# Altium project Fri3D_2020_02.PrjPcb
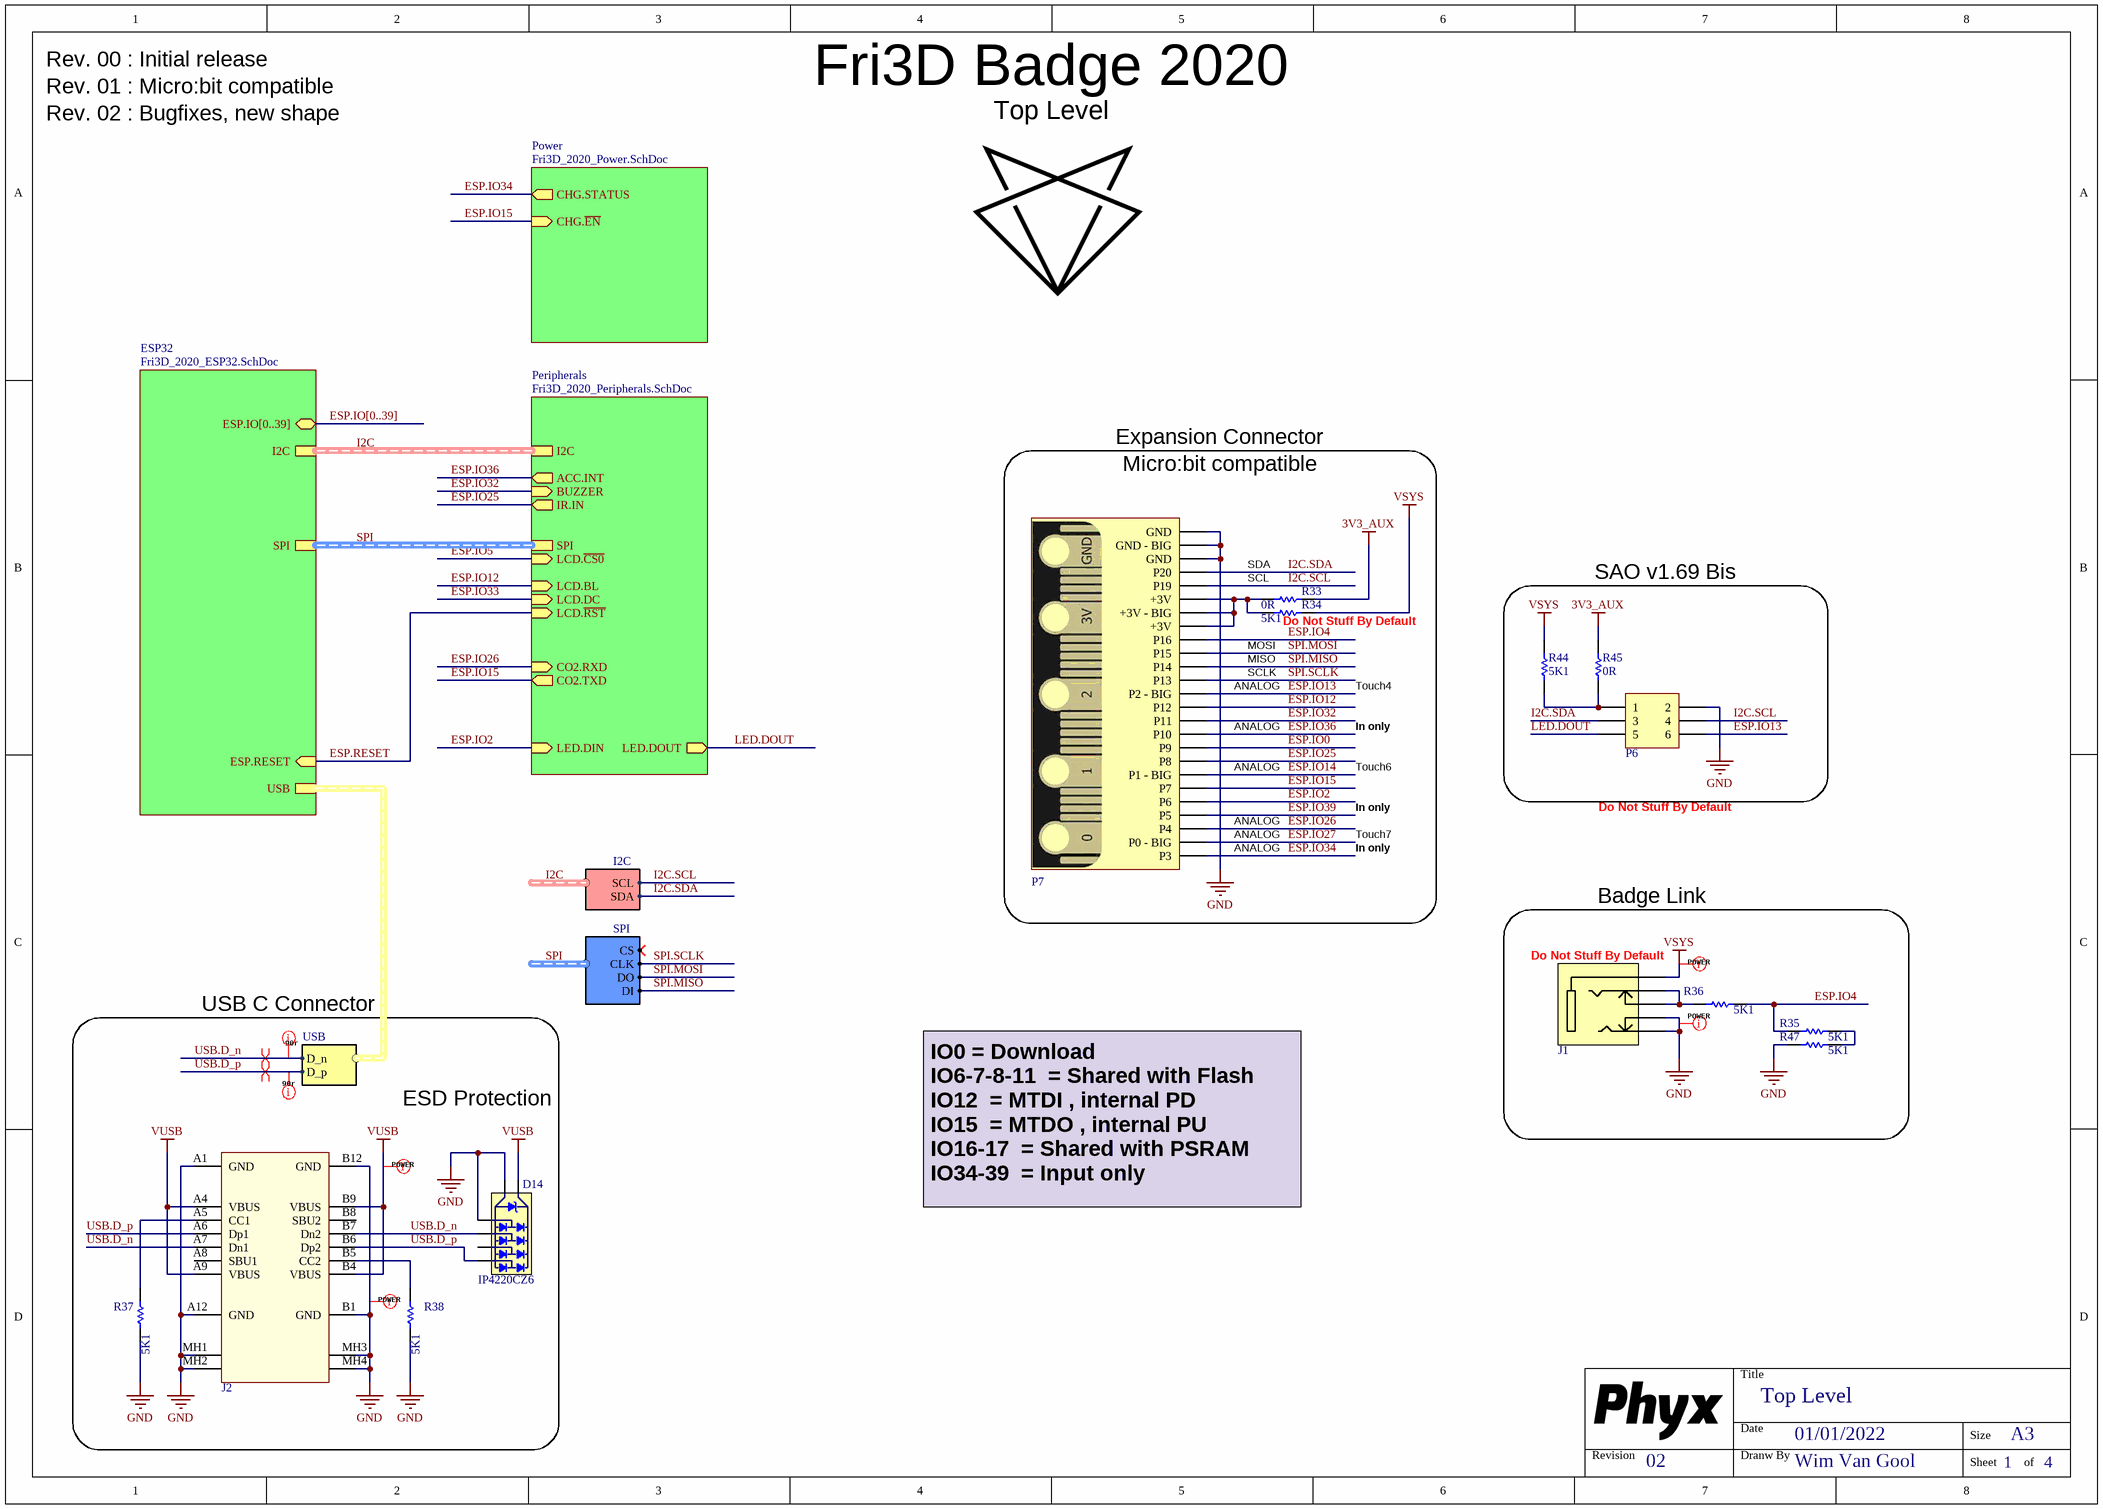
[diagram p0: Fri3D_2020_02.SchDoc]
PCB_ENGINEER: WimVG; PCB_REV: 02; PCB_TITLE: Fri3D Badge 2020
4 sheets, 118 parts. Net scope: hierarchical (ports join the sheet entries above them; power ports are global).
Board file: Fri3D_2020_02.PcbDoc
Sheets:
  Fri3D_2020_02.SchDoc
    Peripherals = Fri3D_2020_Peripherals.SchDoc
    Power = Fri3D_2020_Power.SchDoc
    ESP32 = Fri3D_2020_ESP32.SchDoc

## Sheet Fri3D_2020_02.SchDoc: Top Level
size A3; Date: 01/01/2022; DrawnBy: Wim Van Gool; DocumentNumber: 1; Revision: 02; SheetNumber: 1; SheetTotal: 4

### Parts
D14  value IP4220CZ6  [NXP_SOT457]  (hidden comment: TVS Diode Dual USB)
J1  3.5mm jack, dual switch, black, 3 contacts  [CUI_SJ1-3525NG]  (value not drawn)
J2  USB 2.0 C Reversible Receptacle Horizontal  [HRO_TYPE-C-31-M-12]  (value not drawn)
P6  Receptacle 3x2  [RCPT2X3]  (value not drawn)
P7  MicroBit PCB connector  [MicroBIT_V2_PCB]  (value not drawn)
R33  value 0R  [R0603_N]  (hidden comment: RESISTOR)
R34  value 5K1  [R0603_N]  (hidden comment: RESISTOR)
R35  value 5K1  [R0603_N]  (hidden comment: RESISTOR)
R36  value 5K1  [R0603_N]  (hidden comment: RESISTOR)
R37  value 5K1  [R0603_N]  (hidden comment: RESISTOR)
R38  value 5K1  [R0603_N]  (hidden comment: RESISTOR)
R44  value 5K1  [R0603_N]  (hidden comment: RESISTOR)
R45  value 0R  [R0603_N]  (hidden comment: RESISTOR)
R47  value 5K1  [R0603_N]  (hidden comment: RESISTOR)

### Blocks framed on the sheet
SAO v1.69 Bis: P6 R44 R45
Badge Link: J1 R35 R36 R47

### Sub-sheets
ESP32 = Fri3D_2020_ESP32.SchDoc: I2C (harness I2C), USB (harness USB), SPI (harness SPI), ESP.RESET (in), ESP.IO[0..39] (bidir)
Peripherals = Fri3D_2020_Peripherals.SchDoc: I2C (harness I2C), ACC.INT (out), BUZZER (in), LED.DIN (in), LED.DOUT (out), SPI (harness SPI), IR.IN (out), LCD.DC (in), LCD.~{RST} (in), LCD.~{CS0} (in), LCD.BL (in), CO2.TXD (out), CO2.RXD (in)
Power = Fri3D_2020_Power.SchDoc: CHG.STATUS (out), CHG.~{EN} (in)

### Harnesses
USB: D_p, D_n
I2C: SDA, SCL
SPI: CS, CLK, DO, DI

### Nets
3V3_AUX: R33.1 R45.1
GND: D14.2(GND) D14.3 J1.2(Tip) J1.4 J2.A1(GND) J2.A12(GND) J2.B1(GND) J2.B12(GND) J2.MH1(Tab) J2.MH2(Tab) J2.MH3(Tab) J2.MH4(Tab) P6.2 P7.23(GND) P7.24(GND_-_BIG) P7.25(GND) R37.2 R38.2 R47.2
VSYS: J1.1(Sleeve) R34.2 R44.2
VUSB: D14.5(VBus) J2.A4(VBUS) J2.A9(VBUS) J2.B4(VBUS) J2.B9(VBUS)
ESP.IO0: P7.9(P9)
ESP.IO2: P7.5(P6) ; sheet Peripherals/LED.DIN
ESP.IO4: P7.17(P16) R35.2 R36.1
ESP.IO12: P7.12(P12) ; sheet Peripherals/LCD.BL
ESP.IO13: P6.6 P7.13(P2_-_BIG)
ESP.IO14: P7.7(P1_-_BIG)
ESP.IO15: P7.6(P7) ; sheet Peripherals/CO2.TXD, sheet Power/CHG.~{EN}  [project net CO2.TXD]
ESP.IO25: P7.8(P8) ; sheet Peripherals/IR.IN
ESP.IO26: P7.3(P4) ; sheet Peripherals/CO2.RXD  [project net CO2.RXD]
ESP.IO27: P7.2(P0_-_BIG)
ESP.IO32: P7.11(P11) ; sheet Peripherals/BUZZER  [project net BUZZER]
ESP.IO34: P7.1(P3) ; sheet Power/CHG.STATUS
ESP.IO36: P7.10(P10) ; sheet Peripherals/ACC.INT  [project net ACC.INT2]
ESP.IO39: P7.4(P5)
ESP.RESET: sheet Peripherals/LCD.~{RST}, sheet ESP32/ESP.RESET
I2C.SCL: P6.4 P7.21(P19) ; sheet Peripherals/I2C.SCL
I2C.SDA: P6.3 P7.22(P20) ; sheet Peripherals/I2C.SDA
LED.DOUT: P6.5 ; sheet Peripherals/LED.DOUT
SPI.MISO: P7.15(P14) ; sheet Peripherals/SPI.DI  [project net SPI.DI]
SPI.MOSI: P7.16(P15) ; sheet Peripherals/SPI.DO  [project net SPI.DO]
SPI.SCLK: P7.14(P13) ; sheet Peripherals/SPI.CLK  [project net SPI.CLK]
USB.D_n: D14.1 J2.A7(Dn1) J2.B7(Dn2) ; sheet ESP32/USB.D_n
USB.D_p: D14.6 J2.A6(Dp1) J2.B6(Dp2) ; sheet ESP32/USB.D_p
NetJ1_3: J1.3(Ring) J1.5 R36.2
NetJ2_A5: J2.A5(CC1) R37.1
NetJ2_B5: J2.B5(CC2) R38.1
NetP6_1: P6.1 R44.1 R45.2
NetP7_18: P7.18(+3V) P7.19(+3V_-_BIG) P7.20(+3V) R33.2 R34.1
NetR35_1: R35.1 R47.1

Not connected (* = marked no-connect by the designer): D14 4; J2 A8(SBU1) B8(SBU2)

### Buses and harness runs
bus ESP.IO[0..39] = sheet ESP32/ESP.IO[0..39]
harness I2C = sheet ESP32/I2C = sheet Peripherals/I2C
harness SPI = sheet ESP32/SPI = sheet Peripherals/SPI

### Layout directives
net class 90r: USB.D_n, USB.D_p
differential pair: USB.D_n, USB.D_p
net class POWER: GND, VSYS, VUSB

### Notes on the sheet
- Rev. 00 : Initial release
- Rev. 01 : Micro:bit compatible
- Rev. 02 : Bugfixes, new shape
- Expansion Connector
- Micro:bit compatible
- SDA
- SCL
- MOSI
- (near R34) Do Not Stuff By Default
- ANALOG
- MISO
- SCLK
- Touch4
- Touch6
- In only
- Touch7
- Do Not Stuff By Default
- (near J1) Do Not Stuff By Default
- USB C Connector
- ESD Protection
- IO0	= Download
  IO6-7-8-11 	= Shared with Flash
  IO12 	= MTDI , internal PD
  IO15 	= MTDO , internal PU
  IO16-17 	= Shared with PSRAM
  IO34-39 	= Input only
- Title
- Revision
- Date
- Dranw By
- Size
- A3
- Sheet
- of

### Library data of the parts
D14 = TVS # IP4220CZ6 Dual USB: =Description; Supplier 1: Farnell; Supplier Part Number 1: 2143248
J1 = AUDIO JACK 3.5 3c SJ1-3525NG: =Description; Value: SJ1-3525NG; Supplier 1: Digi-key; Supplier Part Number 1: CP1-3525NG-ND
J2 = USB # C 2.0 RCPT TYPE-C-31-M-12: Value: TYPE-C-31-M-12; Supplier 1: China; Supplier Part Number 1: HRO TYPE-C-31-M-12; Supplier 2: LCSC; Supplier Part Number 2: C165948; Supplier 3: LCSC ALT; Supplier Part Number 3: C167321 / C319148
P6 = Receptacle 2.54mm dual row 6way
P7 = MicroBit # PCB part: Supplier 1: NO PART
R33 R45 = RES # 0R 0603: Supplier 1: Farnell; Supplier Part Number 1: 2447743; Supplier 3: Generic; Supplier Part Number 3: 0R 1% 0603
R34-R38 R44 R47 = RES # 5K1 0603: Supplier 1: Farnell; Supplier Part Number 1: 2845922
  R36: Supplier 2: LCSC; Supplier Part Number 2: C112314; Supplier 3: Generic; Supplier Part Number 3: 5K1 1% 0603

## Sheet Fri3D_2020_Peripherals.SchDoc: Peripherals
size A3; Date: 01/01/2022; DrawnBy: Wim Van Gool; DocumentNumber: 3; Revision: 02; SheetNumber: 3; SheetTotal: 4
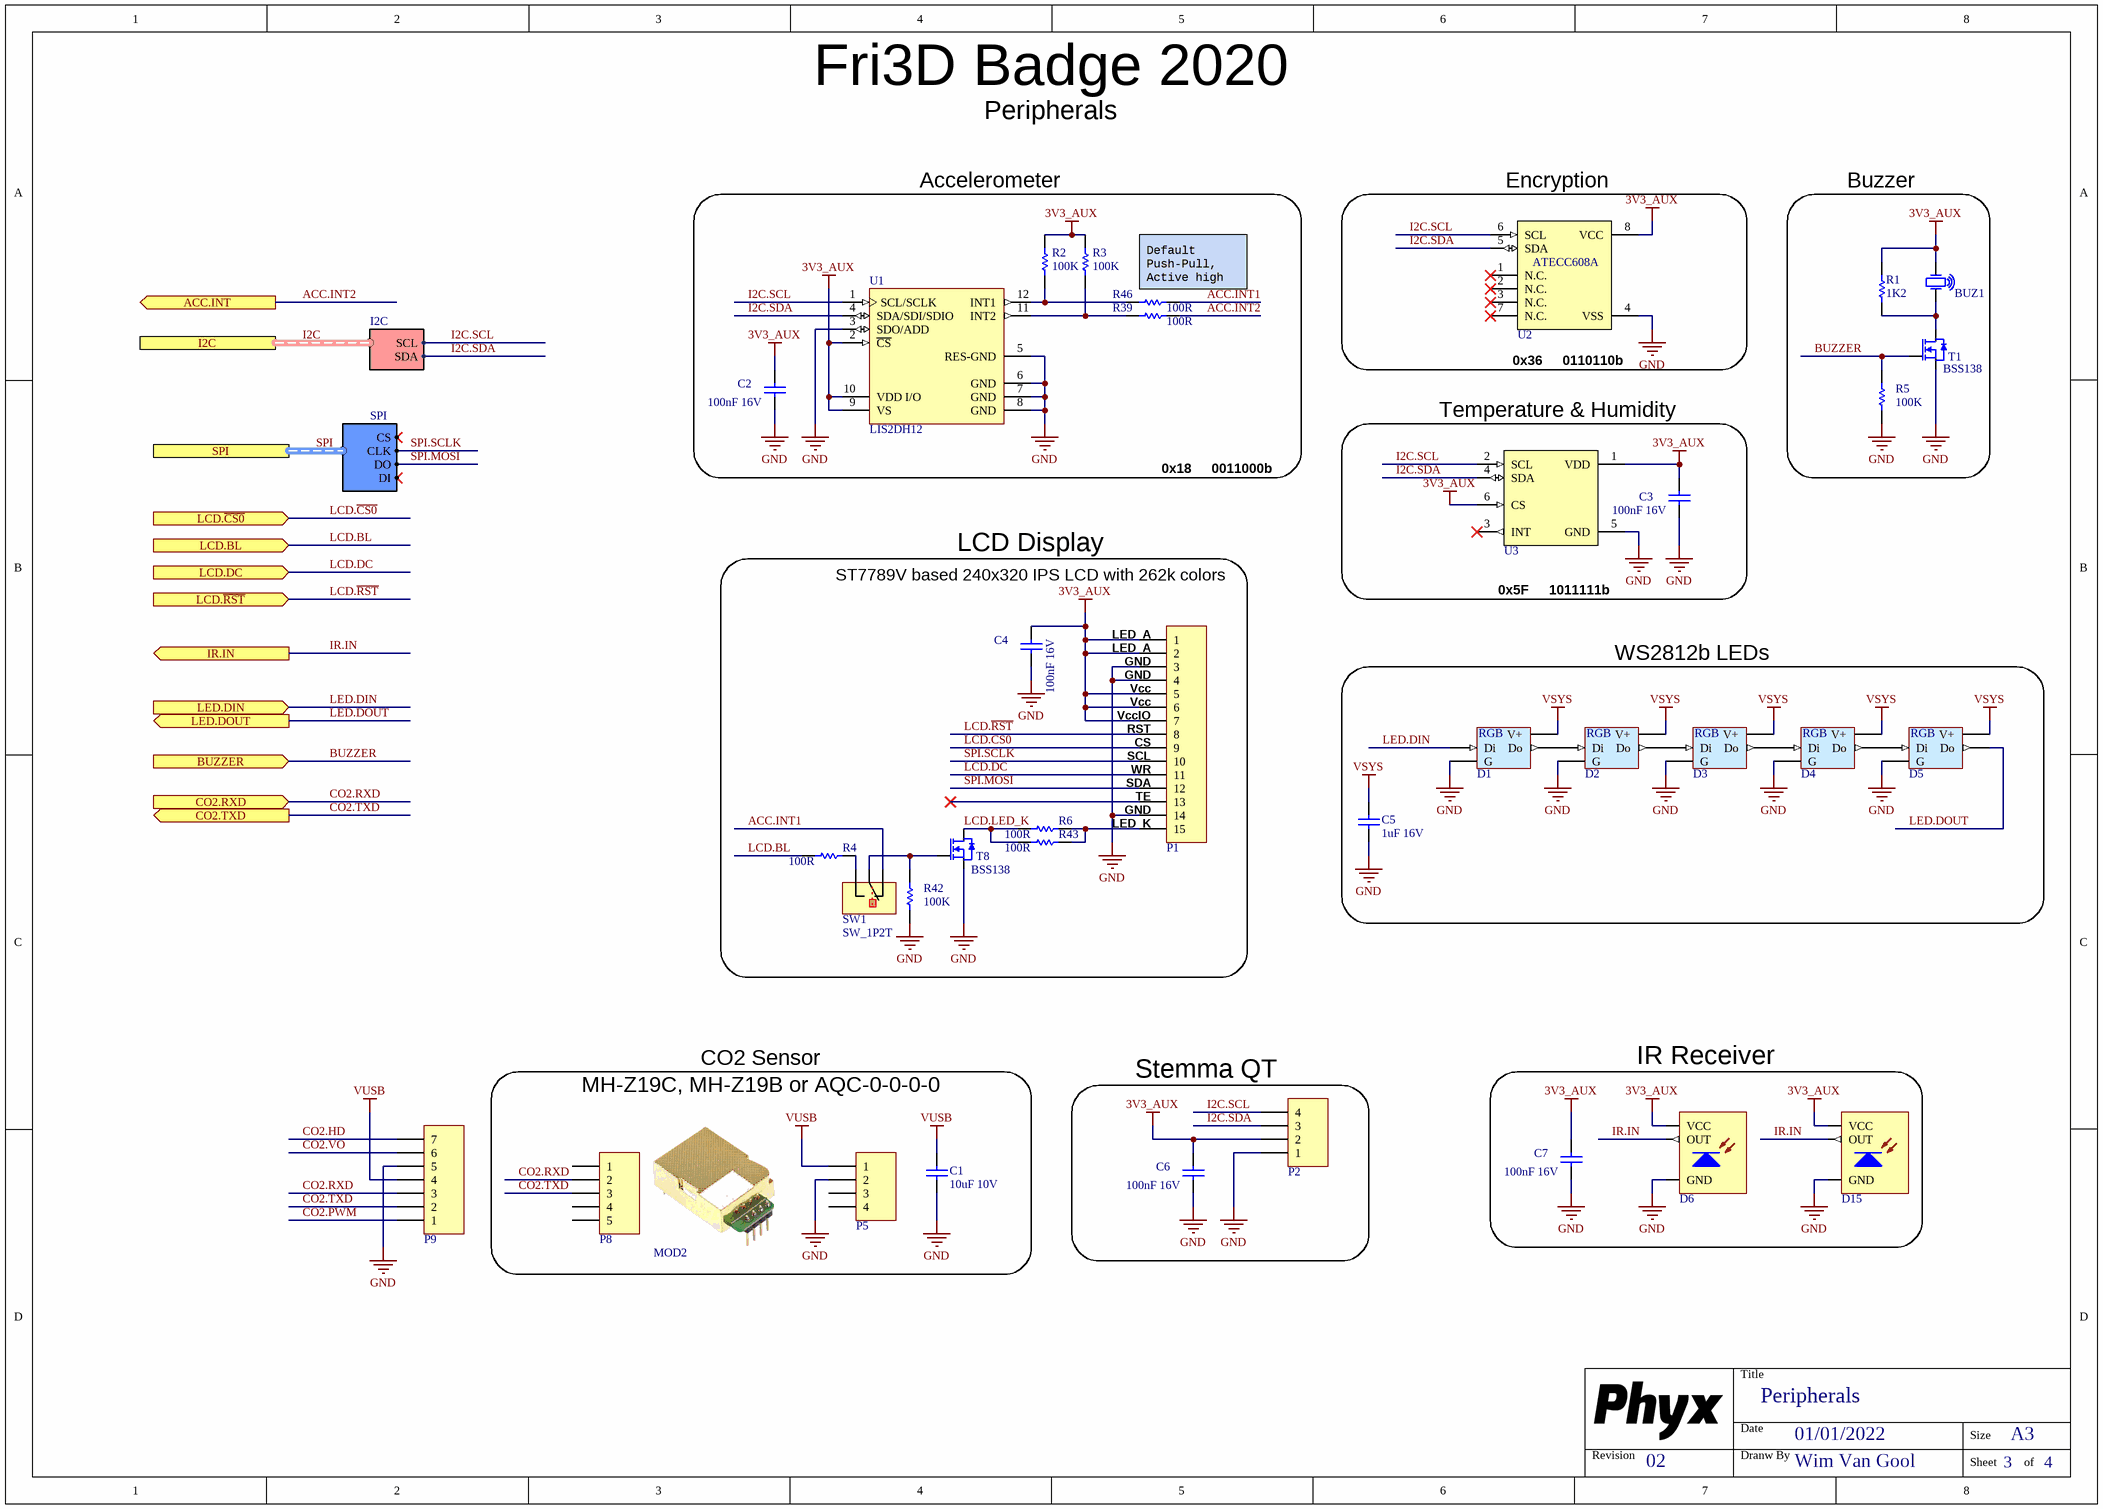
[diagram p1: Fri3D_2020_Peripherals.SchDoc]

### Parts
BUZ1  12x12x3mm Piezo Buzzer Transducer 81dB  [CUI_CMT-1203-SMT]  (value not drawn)
C1  value 10uF 10V  [C0805_N]  (hidden comment: CAP_CERAMIC)
C2  value 100nF 16V  [C0603_N]
C3  value 100nF 16V  [C0603_N]
C4  value 100nF 16V  [C0603_N]
C5  value 1uF 16V  [C0603_N]  (hidden comment: CAP_CERAMIC)
C6  value 100nF 16V  [C0603_N]
C7  value 100nF 16V  [C0603_N]
D1  WS2812 based digital RGB LED 5050 Black package  [LED_5050_WS2812B_BLACK]  (value not drawn)
D2  WS2812 based digital RGB LED 5050 Black package  [LED_5050_WS2812B_BLACK]  (value not drawn)
D3  WS2812 based digital RGB LED 5050 Black package  [LED_5050_WS2812B_BLACK]  (value not drawn)
D4  WS2812 based digital RGB LED 5050 Black package  [LED_5050_WS2812B_BLACK]  (value not drawn)
D5  WS2812 based digital RGB LED 5050 Black package  [LED_5050_WS2812B_BLACK]  (value not drawn)
D6  IRM-3638N3F14 Infrared Receiver 38 kHz 45° 2.7-5.5V  [VIS_TSOP381x_BENT]  (value not drawn)
D15  ZIRM-5042B-42-Z2 Infrared Receiver 38 kHz 45° 2.7-5.5V 940nm  [CHAU_ZIRM-5042B-42-Z2]  (value not drawn)
MOD2  MH-Z19C CO2 Sensor TH Pins  [WIN_MH-Z19x-PH]  (value not drawn)
P1  Bottom contact FPC 0.3mm pitch 15 contacts  [FPC_AFE03-S15FMA-1H]  (value not drawn)
P2  Header 1.0mm RA Shrouded 4  [WE_665104131822]  (value not drawn)
P5  Receptacle 4 SMD Type 2  [WE_61000413321]  (value not drawn)
P8  Receptacle 5 SMD Type 2  [WE_61000513321]  (value not drawn)
P9  Molex Picoblade SMD RA 532610771  [MLX_53261-0771]  (value not drawn)
R1  value 1K2  [R0603_N]  (hidden comment: RESISTOR)
R2  value 100K  [R0603_N]  (hidden comment: RESISTOR)
R3  value 100K  [R0603_N]  (hidden comment: RESISTOR)
R4  value 100R  [R0603_N]  (hidden comment: RESISTOR)
R5  value 100K  [R0603_N]  (hidden comment: RESISTOR)
R6  value 100R  [R0603_N]  (hidden comment: RESISTOR)
R39  value 100R  [R0603_N]  (hidden comment: RESISTOR)
R42  value 100K  [R0603_N]  (hidden comment: RESISTOR)
R43  value 100R  [R0603_N]  (hidden comment: RESISTOR)
R46  value 100R  [R0603_N]  (hidden comment: RESISTOR)
SW1  SW_1P2T  [WE_450404015514]
T1  value BSS138  [SOT23-3]  (hidden comment: 0.2A N-Ch MOSFET Vgs 3.2)
T8  value BSS138  [SOT23-3]  (hidden comment: 0.2A N-Ch MOSFET Vgs 3.2)
U1  LIS2DH12  [STM_LGA12_2x2]
U2  Encryption Authentication with 72b SN, SHA-256, AES-128  [SOIC_N_8]  (value not drawn)
U3  WSEN-HIDS 2525020210001 temperature and humidity sensor Digital I2C  [WE_2525020210001]  (value not drawn)

### Blocks framed on the sheet
Accelerometer: C2 R2 R3 R39 R46 U1
Encryption: U2
Buzzer: BUZ1 R1 R5 T1
Temperature & Humidity: C3 U3
LCD Display: C4 P1 R4 R6 R42 R43 SW1 T8
WS2812b LEDs: C5 D1-D5
Stemma QT: C6 P2
IR Receiver: C7 D6 D15

### Ports
ACC.INT (out), BUZZER (in), CO2.RXD (in), CO2.TXD (out), I2C (harness I2C), IR.IN (out), LCD.BL (in), LCD.DC (in), LCD.~{CS0} (in), LCD.~{RST} (in), LED.DIN (in), LED.DOUT (out), SPI (harness SPI)

### Harnesses
I2C: SDA, SCL
SPI: CS, CLK, DO, DI

### Nets
3V3_AUX: BUZ1.1(OSC1) C2.1 C3.1 C4.1 C6.1 C7.1 D6.3(VCC) D15.3(VCC) P1.1 P1.2 P1.5 P1.6 P1.7 P2.2 R1.1 R2.1 R3.1 U1.2(~{CS}) U1.9(VS) U1.10(VDD_I/O) U2.8(VCC) U3.1(VDD) U3.6(CS)
GND: C1.2 C2.2 C3.2 C4.2 C5.2 C6.2 C7.2 D1.3(G) D2.3(G) D3.3(G) D4.3(G) D5.3(G) D6.2(GND) D15.2(GND) P1.3 P1.4 P1.14 P2.1 P5.2 P9.5 R5.2 R42.2 T1.2(S) T8.2(S) U1.3(SDO/ADD) U1.5(RES-GND) U1.6(GND) U1.7(GND) U1.8(GND) U2.4(VSS) U3.5(GND)
VSYS: C5.1 D1.1(V+) D2.1(V+) D3.1(V+) D4.1(V+) D5.1(V+)
VUSB: C1.1 P5.1 P9.4
ACC.INT1: R46.2 SW1.1
ACC.INT2: R39.2 ; port ACC.INT
BUZZER: R5.1 T1.1(G) ; port BUZZER
CO2.HD: P9.7
CO2.PWM: P9.1
CO2.RXD: P8.2 P9.3 ; port CO2.RXD
CO2.TXD: P8.3 P9.2 ; port CO2.TXD
CO2.VO: P9.6
I2C.SCL: P2.4 U1.1(SCL/SCLK) U2.6(SCL) U3.2(SCL) ; port I2C.SCL
I2C.SDA: P2.3 U1.4(SDA/SDI/SDIO) U2.5(SDA) U3.4(SDA) ; port I2C.SDA
IR.IN: D6.1(OUT) D15.1(OUT) ; port IR.IN  [project net ESP.IO25]
LCD.BL: R4.2 ; port LCD.BL  [project net ESP.IO12]
LCD.~{CS0}: P1.9 ; port LCD.~{CS0}  [project net ESP.IO5]
LCD.DC: P1.11 ; port LCD.DC  [project net ESP.IO33]
LCD.LED_K: R6.2 R43.2 T8.3(D)
LCD.~{RST}: P1.8 ; port LCD.~{RST}  [project net ESP.RESET]
LED.DIN: D1.4(Di) ; port LED.DIN  [project net ESP.IO2]
LED.DOUT: D5.2(Do) ; port LED.DOUT
SPI.MOSI: P1.12 ; port SPI.DO  [project net SPI.DO]
SPI.SCLK: P1.10 ; port SPI.CLK  [project net SPI.CLK]
NetBUZ1_2: BUZ1.2(OSC2) R1.2 T1.3(D)
NetD1_2: D1.2(Do) D2.4(Di)
NetD2_2: D2.2(Do) D3.4(Di)
NetD3_2: D3.2(Do) D4.4(Di)
NetD4_2: D4.2(Do) D5.4(Di)
NetP1_15: P1.15 R6.1 R43.1
NetR2_2: R2.2 R46.1 U1.12(INT1)
NetR3_2: R3.2 R39.1 U1.11(INT2)
NetR4_1: R4.1 SW1.3
NetR42_1: R42.1 SW1.2 T8.1(G)

Not connected (* = marked no-connect by the designer): P1 13*; P5 3 4; P8 1 4 5; U2 1(N.C.)* 2(N.C.)* 3(N.C.)* 7(N.C.)*; U3 3(INT)*

### Buses and harness runs
harness I2C = port I2C
harness SPI = port SPI

### Notes on the sheet
- (near R46) Default Push-Pull, Active high
- (near U2) 0x36
- (near U2) 0110110b
- 0x18
- 0011000b
- ST7789V based 240x320 IPS LCD with 262k colors
- (near P1) LED_A
- (near P1) GND
- (near U3) 0x5F
- (near U3) 1011111b
- (near P1) Vcc
- (near P1) VccIO
- (near P1) RST
- (near P1) CS
- (near P1) SCL
- (near P1) WR
- (near P1) SDA
- (near P1) TE
- (near P1) LED_K
- CO2 Sensor
- MH-Z19C, MH-Z19B or AQC-0-0-0-0
- Title
- Revision
- Date
- Dranw By
- Size
- A3
- Sheet
- of
- (in symbol CRYPTO # ATECC608A I2C SOIC-8) ATECC608A
- (in symbol LED # RGB WS2812B-5050 BL) RGB

### Library data of the parts
BUZ1 = BUZ # CUI CMT-1203-SMT: Crystal Oscillator; Value: CMT-1203-SMT; Supplier 1: Digikey; Supplier Part Number 1: 102-2197-1-ND; Supplier 2: Aliexpress; Supplier Part Number 2: KLJ-1230
C1 = CAP # 10uF 10V 0805: Capacitor Ceramic; Supplier 1: Farnell; Supplier Part Number 1: 2320859
C2-C4 C6 C7 = CAP # 100nF 16V 0603: Capacitor Ceramic
C5 = CAP # 1uF 16V 0603: Capacitor Ceramic; Supplier 1: Farnell; Supplier Part Number 1: 2320814
D1-D5 = LED # RGB WS2812B-5050 BL: =Description; Value: WS218B 5050 BL; Supplier 1: Aliexpress; Supplier Part Number 1: WS2812B Black 5050
D6 = PHO IR Rx RA: =Description; Value: IRM-3638N3F14; Supplier 1: LCSC; Supplier Part Number 1: C264262
D15 = PHO # IR Rx 940nm ZIRM-5042B-42-Z2: =Description; Value: ZIRM-5042B-42-Z2; Supplier 1: LCSC; Supplier Part Number 1: C575386
MOD2 = CO2 MH-Z19C-PH: Winsen MH-Z19x-PH series of CO2 sensors; Description: CO2 MH-Z19C-PH; Supplier 1: Reichelt; Supplier Part Number 1: CO2 MH-Z19C-PH
P1 = FPC # 15 Bottom 0.3mm AFE03-S15FMA-1H: Value: AFE03-S15FMA-1H; Supplier 1: LCSC; Supplier Part Number 1: C262541
P2 = HDR # RA SHR 1.0mm 4way - 665104131822: Value: 665104131822; Supplier 1: Wurth; Supplier Part Number 1: 665104131822; Supplier 2: Mouser; Supplier Part Number 2: 710-665104131822
P5 = Receptacle # 2.54mm 4way Type 2: Value: 61000413321; Description: Receptacle # 2.54mm 4way Type 2; Supplier 1: Wurth; Supplier Part Number 1: 61000413321
P8 = Receptacle # 2.54mm 5way Type 2: Value: 61000513321; Description: Receptacle # 2.54mm 5way Type 2; Supplier 1: Wurth; Supplier Part Number 1: 61000513321
P9 = HDR # RA SHR 1.25mm 7way Molex Picoblade: Description: HDR # RA SHR 1.25mm 7way Molex Picoblade; Value: 532610771; Supplier 1: LCSC; Supplier Part Number 1: C505276; Supplier 2: Farnell; Supplier Part Number 2: 1125361; Supplier 3: Digi-Key; Supplier Part Number 3: WM7625CT-ND
R1 = RES # 1K2 0603
R2 R3 R5 R42 = RES # 100K 0603: Supplier 3: Generic; Supplier Part Number 3: 100K 1% 0603
R4 R6 R39 R43 R46 = RES # 100R 0603
SW1 = SW # 1P2T WS-SLSU mini slide 6,7 x 2,7 mm
T1 T8 = BSS138 N-Ch MOSFET 0.2A 3.2Vgs 60Vds: Supplier 1: Farnell; Supplier Part Number 1: 2432717
U1 = ACCELERO # LIS2DH12: =Description
U2 = CRYPTO # ATECC608A I2C SOIC-8: =Description; Value: ATECC608A-SSHDA-T; Supplier 1: Farnell; Supplier Part Number 1: 2920872; Supplier 2: Digi-key; Supplier Part Number 2: ATECC608A-SSHDA-TCT-ND; Supplier 3: Mouser; Supplier Part Number 3: 556-ATECC608ASSHDAT
U3 = TMP HUM # WSEN-HIDS: =Description; Value: 2525020210001; Supplier 1: Digi-key; Supplier Part Number 1: 1917-2525020210001CT-ND; Supplier 2: Farnell; Supplier Part Number 2: 3759082; Supplier 3: Mouser; Supplier Part Number 3: 710-2525020210001

## Sheet Fri3D_2020_Power.SchDoc: Power
size A3; Date: 01/01/2022; DrawnBy: Wim Van Gool; DocumentNumber: 4; Revision: 02; SheetNumber: 4; SheetTotal: 4
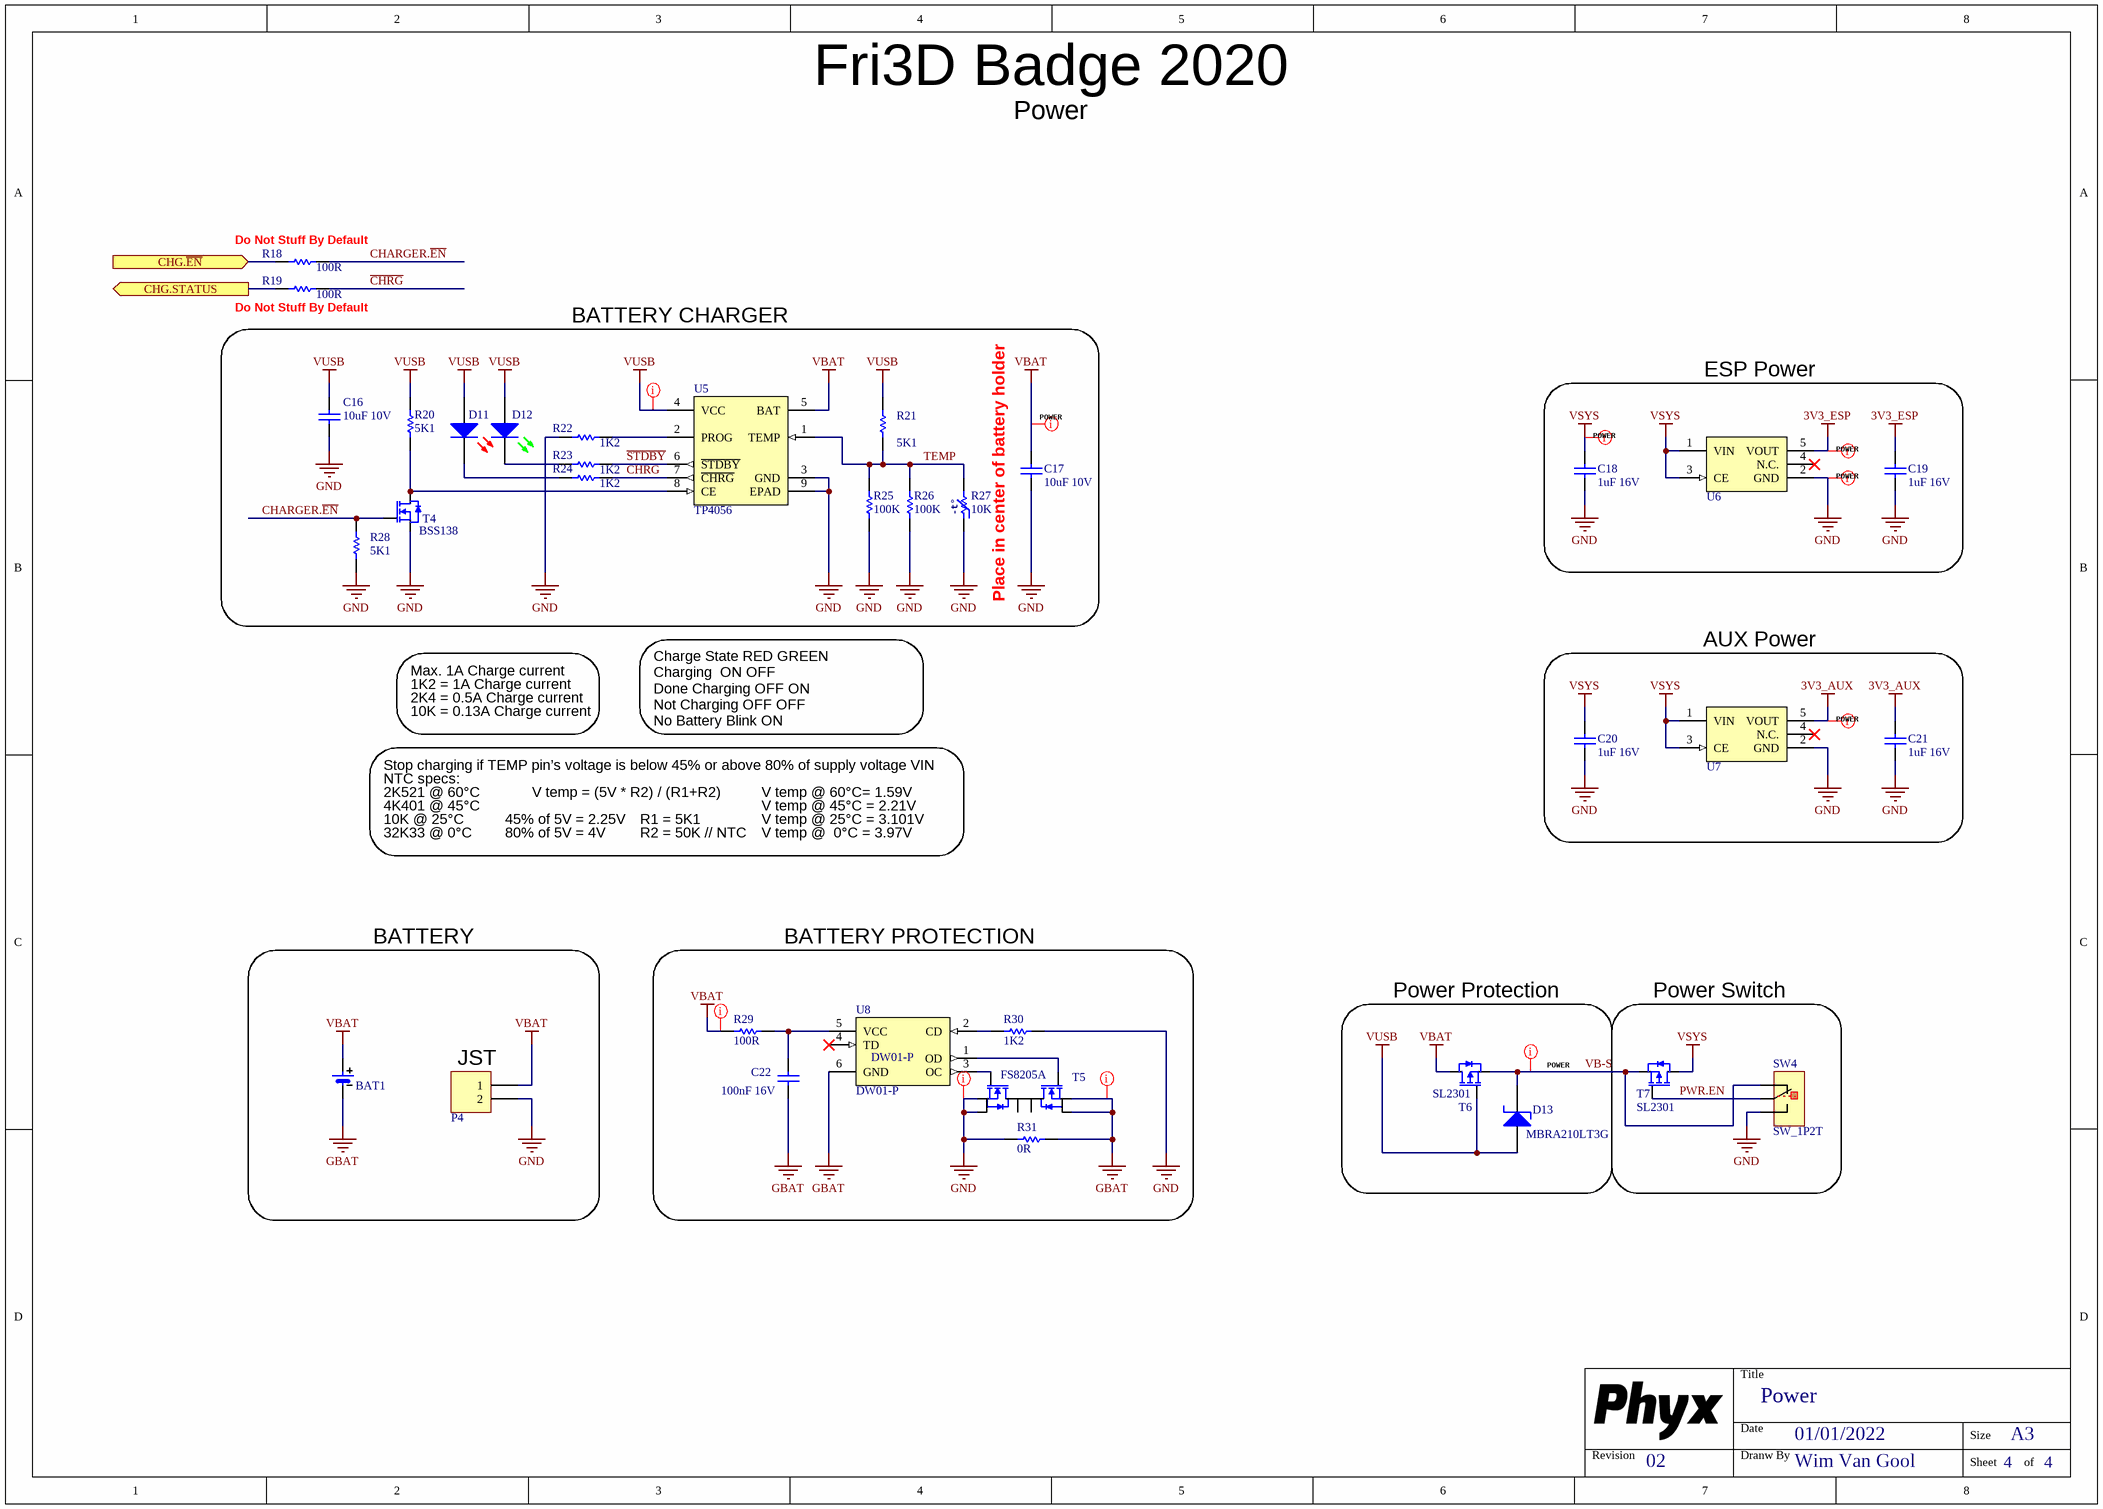
[diagram p2: Fri3D_2020_Power.SchDoc]

### Parts
BAT1  18650 Battery holder with spring  [BAT_18650_SPRING]  (value not drawn)
C16  value 10uF 10V  [C0805_N]  (hidden comment: CAP_CERAMIC)
C17  value 10uF 10V  [C0805_N]  (hidden comment: CAP_CERAMIC)
C18  value 1uF 16V  [C0603_N]  (hidden comment: CAP_CERAMIC)
C19  value 1uF 16V  [C0603_N]  (hidden comment: CAP_CERAMIC)
C20  value 1uF 16V  [C0603_N]  (hidden comment: CAP_CERAMIC)
C21  value 1uF 16V  [C0603_N]  (hidden comment: CAP_CERAMIC)
C22  value 100nF 16V  [C0603_N]
D11  Default 0805 Red LED  [LED_0805_RD]  (value not drawn)
D12  Default 0805 Green LED  [LED_0805_GR]  (value not drawn)
D13  MBRA210LT3G  [SMA_AC]
P4  Header 2.0mm Shrouded 2  [WE_620102131822]  (value not drawn)
R18  value 100R  [R0603_N]  (hidden comment: RESISTOR)
R19  value 100R  [R0603_N]  (hidden comment: RESISTOR)
R20  value 5K1  [R0603_N]  (hidden comment: RESISTOR)
R21  value 5K1  [R0603_N]  (hidden comment: RESISTOR)
R22  value 1K2  [R0603_N]  (hidden comment: RESISTOR)
R23  value 1K2  [R0603_N]  (hidden comment: RESISTOR)
R24  value 1K2  [R0603_N]  (hidden comment: RESISTOR)
R25  value 100K  [R0603_N]  (hidden comment: RESISTOR)
R26  value 100K  [R0603_N]  (hidden comment: RESISTOR)
R27  value 10K  [R0402]  (hidden comment: NTC)
R28  value 5K1  [R0603_N]  (hidden comment: RESISTOR)
R29  value 100R  [R0603_N]  (hidden comment: RESISTOR)
R30  value 1K2  [R0603_N]  (hidden comment: RESISTOR)
R31  value 0R  [R0603_N]
SW4  SW_1P2T  [WE_450404015514]
T4  value BSS138  [SOT23-3]  (hidden comment: 0.2A N-Ch MOSFET Vgs 3.2)
T5  value FS8205A  [TSSOP_8_65P]  (hidden comment: Dual N-Ch MOSFET Common Drain)
T6  value SL2301  [SOT23-3]  (hidden comment: -2.3A -20V P-Ch MOSFET Vgs -1V)
T7  value SL2301  [SOT23-3]  (hidden comment: -2.3A -20V P-Ch MOSFET Vgs -1V)
U5  value TP4056  [SOIC_N_8_TH]  (hidden comment: Single Cell LiIon charger max 1A)
U6  3V3 LDO 700mA 50mV  [SOT23-5]  (value not drawn)
U7  3V3 LDO 700mA 50mV  [SOT23-5]  (value not drawn)
U8  value DW01-P  [SOT23-6]  (hidden comment: DW01-P single cell lithium protection)

### Blocks framed on the sheet
BATTERY CHARGER: C16 C17 D11 D12 R20-R28 T4 U5
ESP Power: C18 C19 U6
AUX Power: C20 C21 U7
BATTERY PROTECTION: C22 R29-R31 T5 U8
Power Protection: D13 T6
Power Switch: SW4 T7

### Ports
CHG.STATUS (out), CHG.~{EN} (in)

### Nets
3V3_AUX: C21.1 U7.5(VOUT)
3V3_ESP: C19.1 U6.5(VOUT)
GBAT: BAT1.2 C22.2 R31.1 T5.2(S1) T5.3(S1) U8.6(GND)
GND: C16.2 C17.2 C18.2 C19.2 C20.2 C21.2 P4.2 R22.2 R25.2 R26.2 R27.2 R28.2 R30.2 R31.2 SW4.3 T4.2(S) T5.6(S2) T5.7(S2) U5.3(GND) U5.9(EPAD) U6.2(GND) U7.2(GND)
VBAT: BAT1.1 C17.1 P4.1 R29.1 T6.3(D) U5.5(BAT)
VSYS: C18.1 C20.1 T7.3(D) U6.1(VIN) U6.3(CE) U7.1(VIN) U7.3(CE)
VUSB: C16.1 D11.1(A) D12.1(A) D13.A R20.1 R21.1 T6.1(G) U5.4(VCC)
~{CHRG}: R19.2 R24.2 U5.7(~{CHRG})
CHARGER.~{EN}: R18.2 R28.1 T4.1(G)
CO2.TXD: R18.1 ; port CHG.~{EN}
ESP.IO34: R19.1 ; port CHG.STATUS
PWR.EN: SW4.2 T7.1(G)
~{STDBY}: R23.2 U5.6(~{STDBY})
TEMP: R21.2 R25.1 R26.1 R27.1 U5.1(TEMP)
VB-S: D13.C SW4.1 T6.2(S) T7.2(S)
NetC22_1: C22.1 R29.2 U8.5(VCC)
NetD11_2: D11.2(K) R24.1
NetD12_2: D12.2(K) R23.1
NetR20_2: R20.2 T4.3(D) U5.8(CE)
NetR22_1: R22.1 U5.2(PROG)
NetR30_1: R30.1 U8.2(CD)
NetT5_4: T5.4(G1) U8.1(OD)
NetT5_5: T5.5(G2) U8.3(OC)

Not connected (* = marked no-connect by the designer): T5 1(D1) 8(D2); U6 4(N.C.)*; U7 4(N.C.)*; U8 4(TD)*

### Layout directives
net class POWER: 3V3_AUX, 3V3_ESP, GBAT, GND, VB-S, VBAT, VSYS, VUSB

### Notes on the sheet
- (near R18) Do Not Stuff By Default
- (near R19) Do Not Stuff By Default
- Place in center of battery holder
- 1K2 = 1A Charge current
- 2K4 = 0.5A Charge current
- Max. 1A Charge current
- 10K = 0.13A Charge current
- Charge State	RED	GREEN
  Charging		ON	OFF
  Done Charging	OFF	ON
  Not Charging	OFF	OFF
  No Battery	Blink	ON
- Stop charging if TEMP pin’s voltage is below 45% or above 80% of supply voltage VIN
- NTC specs:
- 10K @ 25°C
- 32K33 @ 0°C
- 2K521 @ 60°C
- 4K401 @ 45°C
- 45% of 5V = 2.25V
- 80% of 5V = 4V
- V temp = (5V * R2) / (R1+R2)
- R1 = 5K1
- R2 = 50K // NTC
- V temp @ 60°C= 1.59V
- V temp @ 45°C = 2.21V
- V temp @ 25°C = 3.101V
- V temp @  0°C = 3.97V
- BATTERY
- (near P4) JST
- Title
- Revision
- Date
- Dranw By
- Size
- A3
- Sheet
- of
- (in symbol NTC # 10K 0402) -t°

### Library data of the parts
BAT1 = 18650 Battery holder spring CN: =Description; Value: 18650_SPRING; Supplier 1: TaoBao; Supplier Part Number 1: 39761834568
C16 C17 = CAP # 10uF 10V 0805: Capacitor Ceramic; Supplier 1: Farnell; Supplier Part Number 1: 2320859
C18-C21 = CAP # 1uF 16V 0603: Capacitor Ceramic; Supplier 1: Farnell; Supplier Part Number 1: 2320814
C22 = CAP # 100nF 16V 0603: Capacitor Ceramic
D11 = LED # Red 0805: =Description; Supplier 1: Farnell; Supplier Part Number 1: 2099236
D12 = LED # Green 0805: =Description; Supplier 1: Farnell; Supplier Part Number 1: 2099239
D13 = Schottky # MBRA210LT3G: =Description
P4 = HDR # SHR 2.0mm 2way - 620102131822: Value: 620102131822; Supplier 1: Wurth
R18 R19 R29 = RES # 100R 0603
R20 R21 R28 = RES # 5K1 0603: Supplier 1: Farnell; Supplier Part Number 1: 2845922
R22-R24 R30 = RES # 1K2 0603
R25 R26 = RES # 100K 0603
R27 = NTC # 10K 0402: Supplier 1: LCSC; Supplier Part Number 1: C209959; Supplier 2: LCSC; Supplier Part Number 2: C98099
R31 = RES # 0R 0603: Supplier 1: Farnell; Supplier Part Number 1: 2447743
SW4 = SW # 1P2T WS-SLSU mini slide 6,7 x 2,7 mm
T4 = BSS138 N-Ch MOSFET 0.2A 3.2Vgs 60Vds: Supplier 1: Farnell; Supplier Part Number 1: 2432717
T5 = FS8205A Dual N-Ch common Drain for DW01-P: =Description; Supplier 1: AliExpress; Supplier Part Number 1: FS8205A
T6 T7 = SL2301 P-Ch MOSFET -2.3A -20Vds: =Description; Supplier 1: LCSC; Supplier Part Number 1: C181086
U5 = CHG # TP4056 LiIon 1A: =Description; Supplier 1: Aliexpress; Supplier Part Number 1: TP4056
U6 U7 = LDO # 3V3 XC6210B33: =Designator; Value: XC6210B332MR; Supplier 1: Farnell; Supplier Part Number 1: 1057803
U8 = PWR # DW01-P Lithium protection: =Description; Supplier 1: Aliexpress; Supplier Part Number 1: DW01-P

## Sheet Fri3D_2020_ESP32.SchDoc: ESP32 Module
size A3; Date: 01/01/2022; DrawnBy: Wim Van Gool; DocumentNumber: 2; Revision: 02; SheetNumber: 2; SheetTotal: 4
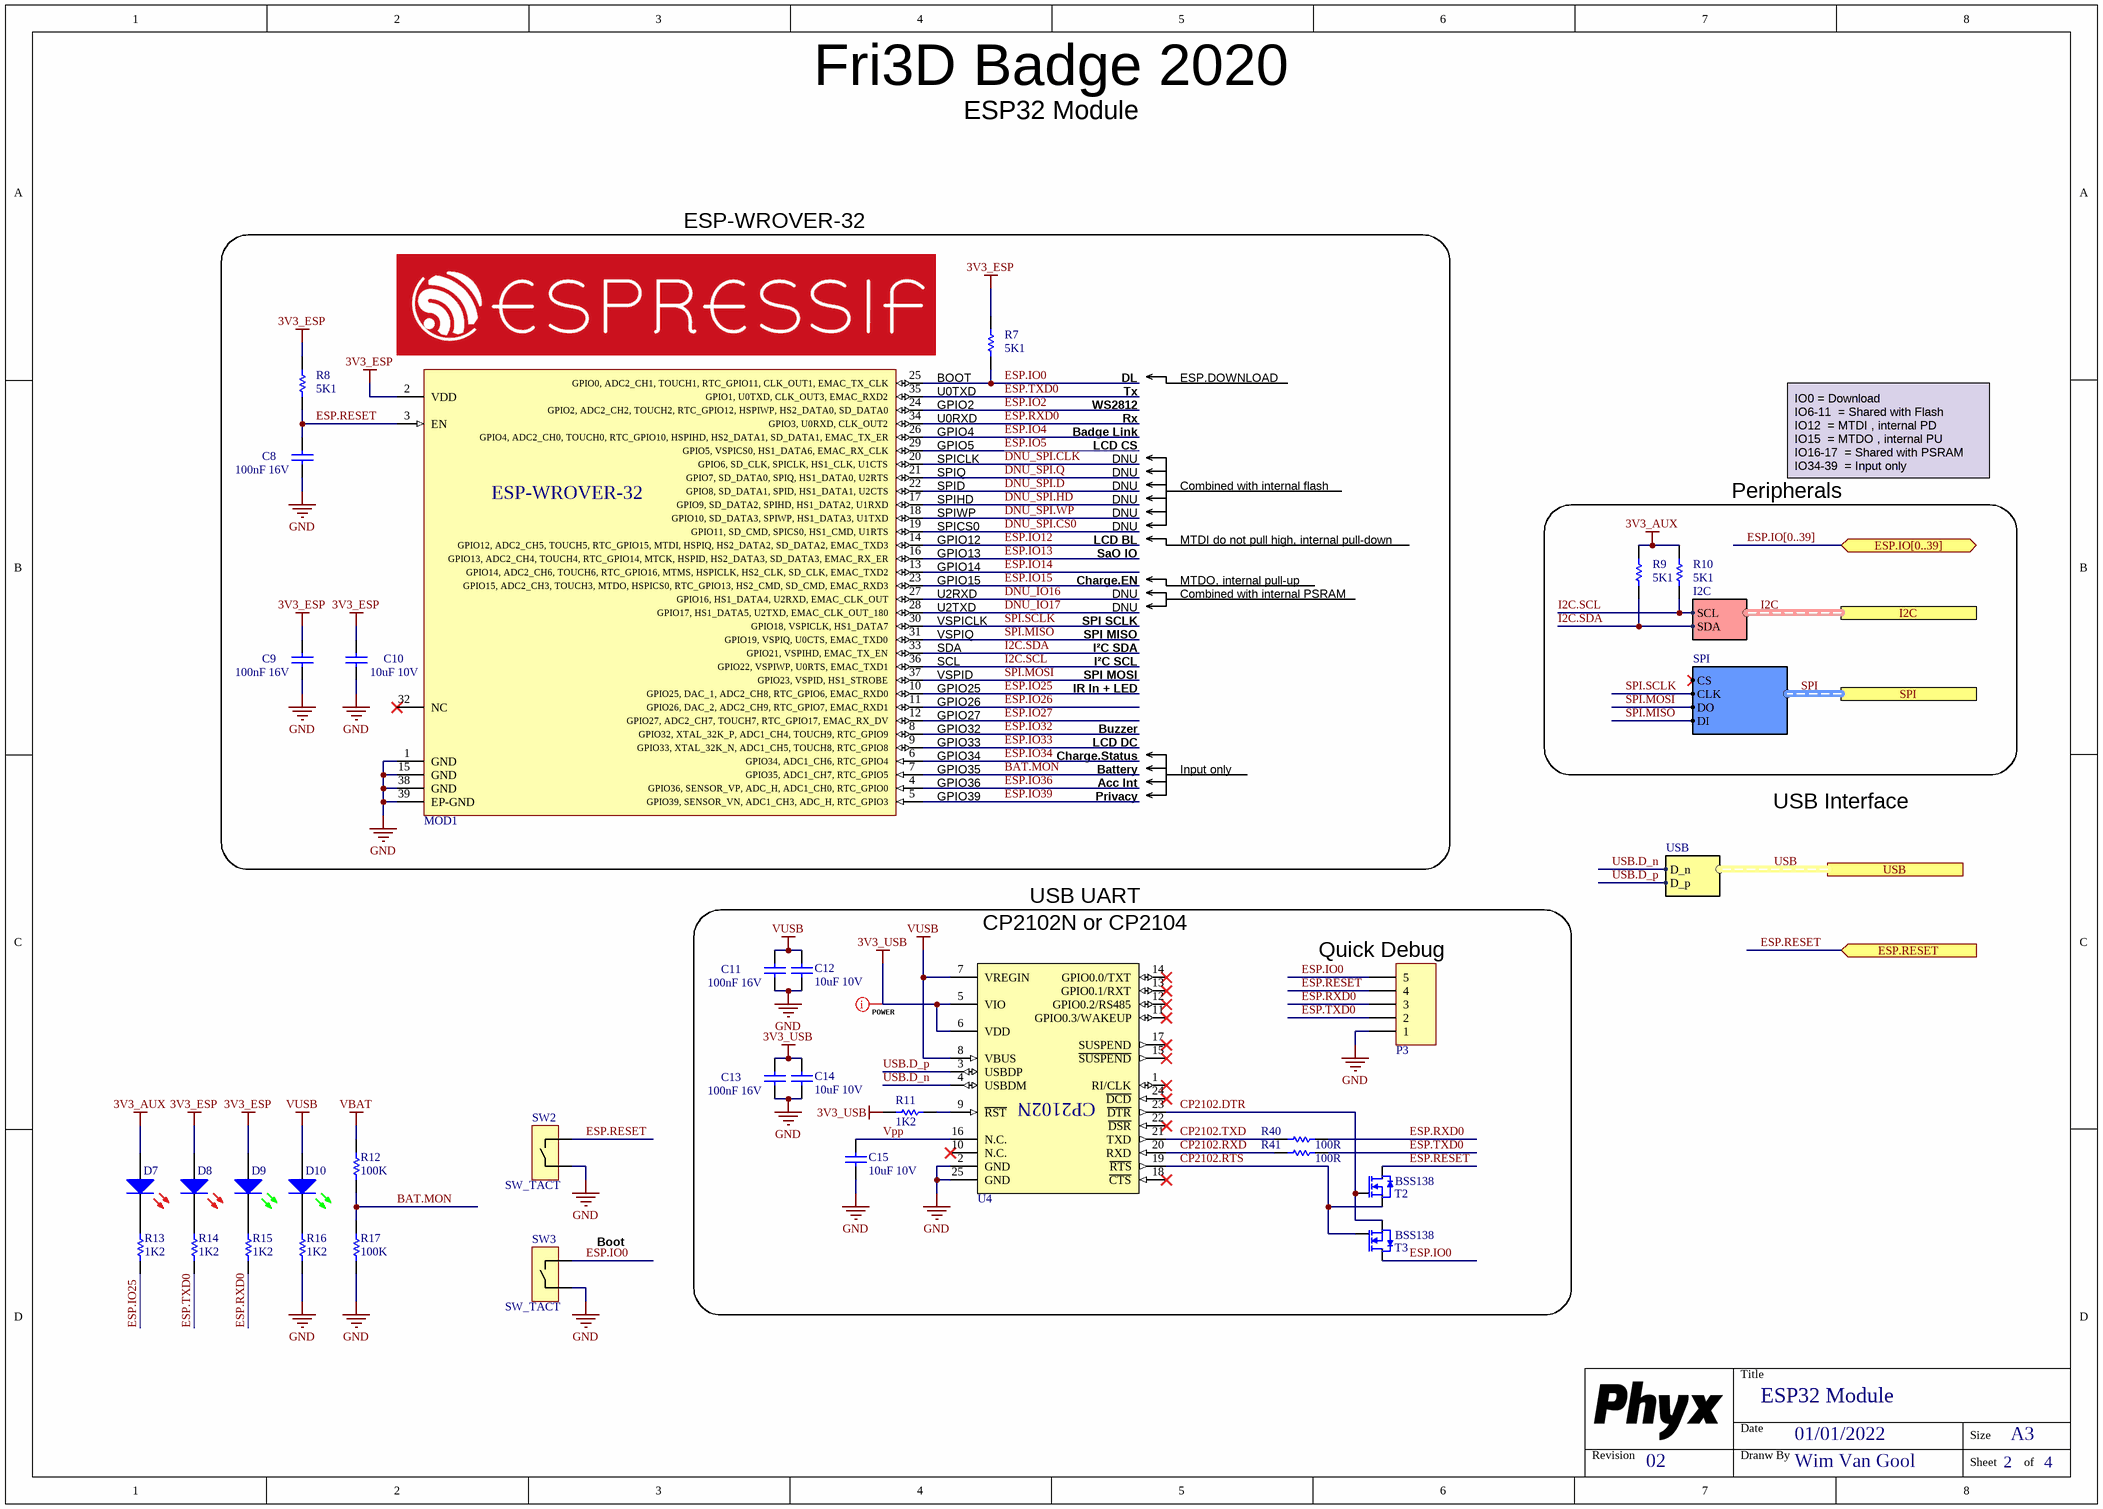
[diagram p3: Fri3D_2020_ESP32.SchDoc]

### Parts
C8  value 100nF 16V  [C0603_N]
C9  value 100nF 16V  [C0603_N]
C10  value 10uF 10V  [C0805_N]  (hidden comment: CAP_CERAMIC)
C11  value 100nF 16V  [C0603_N]
C12  value 10uF 10V  [C0805_N]  (hidden comment: CAP_CERAMIC)
C13  value 100nF 16V  [C0603_N]
C14  value 10uF 10V  [C0805_N]  (hidden comment: CAP_CERAMIC)
C15  value 10uF 10V  [C0805_N]  (hidden comment: CAP_CERAMIC)
D7  Default 0805 Red LED  [LED_0805_RD]  (value not drawn)
D8  Default 0805 Red LED  [LED_0805_RD]  (value not drawn)
D9  Default 0805 Green LED  [LED_0805_GR]  (value not drawn)
D10  Default 0805 Green LED  [LED_0805_GR]  (value not drawn)
MOD1  ESP-32 based ESP-WROVER-32  [ESP-WROVER-32]  (value not drawn)
P3  Header 1.0mm RA Shrouded 5  [WE_665105131822]  (value not drawn)
R7  value 5K1  [R0603_N]  (hidden comment: RESISTOR)
R8  value 5K1  [R0603_N]  (hidden comment: RESISTOR)
R9  value 5K1  [R0603_N]  (hidden comment: RESISTOR)
R10  value 5K1  [R0603_N]  (hidden comment: RESISTOR)
R11  value 1K2  [R0603_N]  (hidden comment: RESISTOR)
R12  value 100K  [R0603_N]  (hidden comment: RESISTOR)
R13  value 1K2  [R0603_N]  (hidden comment: RESISTOR)
R14  value 1K2  [R0603_N]  (hidden comment: RESISTOR)
R15  value 1K2  [R0603_N]  (hidden comment: RESISTOR)
R16  value 1K2  [R0603_N]  (hidden comment: RESISTOR)
R17  value 100K  [R0603_N]  (hidden comment: RESISTOR)
R40  value 100R  [R0603_N]  (hidden comment: RESISTOR)
R41  value 100R  [R0603_N]  (hidden comment: RESISTOR)
SW2  SW_TACT  [WE_430181038816]
SW3  SW_TACT  [WE_430181038816]
T2  value BSS138  [SOT23-3]  (hidden comment: 0.2A N-Ch MOSFET Vgs 3.2)
T3  value BSS138  [SOT23-3]  (hidden comment: 0.2A N-Ch MOSFET Vgs 3.2)
U4  USB to UART 3.3-5V  [QFN_24]  (value not drawn)

### Blocks framed on the sheet
ESP-WROVER-32: C8-C10 MOD1 R7 R8
Peripherals: R9 R10

### Ports
ESP.IO[0..39] (bidir), ESP.RESET (in), I2C (harness I2C), SPI (harness SPI), USB (harness USB)

### Harnesses
I2C: SDA, SCL
USB: D_p, D_n
SPI: CS, CLK, DO, DI

### Nets
3V3_AUX: D7.1(A) R9.1 R10.1
3V3_ESP: C9.1 C10.1 D8.1(A) D9.1(A) MOD1.2(VDD) R7.1 R8.1
3V3_USB: C13.1 C14.2 R11.1 U4.5(VIO) U4.6(VDD)
GND: C8.2 C9.2 C10.2 C11.2 C12.1 C13.2 C14.1 C15.1 MOD1.1(GND) MOD1.15(GND) MOD1.38(GND) MOD1.39(EP-GND) P3.1 R16.2 R17.2 SW2.2 SW3.2 U4.2(GND) U4.25(GND)
VBAT: R12.1
VUSB: C11.1 C12.2 D10.1(A) U4.7(VREGIN) U4.8(VBUS)
BAT.MON: MOD1.7(GPIO35,_ADC1_CH7,_RTC_GPIO5) R12.2 R17.1
CP2102.DTR: T2.1(G) T3.2(S) U4.23(~{DTR})
CP2102.RTS: T2.2(S) T3.1(G) U4.19(~{RTS})
CP2102.RXD: R41.1 U4.20(RXD)
CP2102.TXD: R40.1 U4.21(TXD)
DNU_IO16: MOD1.27(GPIO16,_HS1_DATA4,_U2RXD,_EMAC_CLK_OUT)
DNU_IO17: MOD1.28(GPIO17,_HS1_DATA5,_U2TXD,_EMAC_CLK_OUT_180)
DNU_SPI.CLK: MOD1.20(GPIO6,_SD_CLK,_SPICLK,_HS1_CLK,_U1CTS)
DNU_SPI.CS0: MOD1.19(GPIO11,_SD_CMD,_SPICS0,_HS1_CMD,_U1RTS)
DNU_SPI.D: MOD1.22(GPIO8,_SD_DATA1,_SPID,_HS1_DATA1,_U2CTS)
DNU_SPI.HD: MOD1.17(GPIO9,_SD_DATA2,_SPIHD,_HS1_DATA2,_U1RXD)
DNU_SPI.Q: MOD1.21(GPIO7,_SD_DATA0,_SPIQ,_HS1_DATA0,_U2RTS)
DNU_SPI.WP: MOD1.18(GPIO10,_SD_DATA3,_SPIWP,_HS1_DATA3,_U1TXD)
ESP.IO0: MOD1.25(GPIO0,_ADC2_CH1,_TOUCH1,_RTC_GPIO11,_CLK_OUT1,_EMAC_TX_CLK) P3.5 R7.2 SW3.1 T3.3(D)
ESP.IO2: MOD1.24(GPIO2,_ADC2_CH2,_TOUCH2,_RTC_GPIO12,_HSPIWP,_HS2_DATA0,_SD_DATA0)
ESP.IO4: MOD1.26(GPIO4,_ADC2_CH0,_TOUCH0,_RTC_GPIO10,_HSPIHD,_HS2_DATA1,_SD_DATA1,_EMAC_TX_ER)
ESP.IO5: MOD1.29(GPIO5,_VSPICS0,_HS1_DATA6,_EMAC_RX_CLK)
ESP.IO12: MOD1.14(GPIO12,_ADC2_CH5,_TOUCH5,_RTC_GPIO15,_MTDI,_HSPIQ,_HS2_DATA2,_SD_DATA2,_EMAC_TXD3)
ESP.IO13: MOD1.16(GPIO13,_ADC2_CH4,_TOUCH4,_RTC_GPIO14,_MTCK,_HSPID,_HS2_DATA3,_SD_DATA3,_EMAC_RX_ER)
ESP.IO14: MOD1.13(GPIO14,_ADC2_CH6,_TOUCH6,_RTC_GPIO16,_MTMS,_HSPICLK,_HS2_CLK,_SD_CLK,_EMAC_TXD2)
ESP.IO15: MOD1.23(GPIO15,_ADC2_CH3,_TOUCH3,_MTDO,_HSPICS0,_RTC_GPIO13,_HS2_CMD,_SD_CMD,_EMAC_RXD3)  [project net CO2.TXD]
ESP.IO25: MOD1.10(GPIO25,_DAC_1,_ADC2_CH8,_RTC_GPIO6,_EMAC_RXD0) R13.2
ESP.IO26: MOD1.11(GPIO26,_DAC_2,_ADC2_CH9,_RTC_GPIO7,_EMAC_RXD1)  [project net CO2.RXD]
ESP.IO27: MOD1.12(GPIO27,_ADC2_CH7,_TOUCH7,_RTC_GPIO17,_EMAC_RX_DV)
ESP.IO32: MOD1.8(GPIO32,_XTAL_32K_P,_ADC1_CH4,_TOUCH9,_RTC_GPIO9)  [project net BUZZER]
ESP.IO33: MOD1.9(GPIO33,_XTAL_32K_N,_ADC1_CH5,_TOUCH8,_RTC_GPIO8)
ESP.IO34: MOD1.6(GPIO34,_ADC1_CH6,_RTC_GPIO4)
ESP.IO36: MOD1.4(GPIO36,_SENSOR_VP,_ADC_H,_ADC1_CH0,_RTC_GPIO0)  [project net ACC.INT2]
ESP.IO39: MOD1.5(GPIO39,_SENSOR_VN,_ADC1_CH3,_ADC_H,_RTC_GPIO3)
ESP.RESET: C8.1 MOD1.3(EN) P3.4 R8.2 SW2.1 T2.3(D) ; port ESP.RESET
ESP.RXD0: MOD1.34(GPIO3,_U0RXD,_CLK_OUT2) P3.3 R15.2 R40.2
ESP.TXD0: MOD1.35(GPIO1,_U0TXD,_CLK_OUT3,_EMAC_RXD2) P3.2 R14.2 R41.2
I2C.SCL: MOD1.36(GPIO22,_VSPIWP,_U0RTS,_EMAC_TXD1) R10.2 ; port I2C.SCL
I2C.SDA: MOD1.33(GPIO21,_VSPIHD,_EMAC_TX_EN) R9.2 ; port I2C.SDA
SPI.MISO: MOD1.31(GPIO19,_VSPIQ,_U0CTS,_EMAC_TXD0) ; port SPI.DI  [project net SPI.DI]
SPI.MOSI: MOD1.37(GPIO23,_VSPID,_HS1_STROBE) ; port SPI.DO  [project net SPI.DO]
SPI.SCLK: MOD1.30(GPIO18,_VSPICLK,_HS1_DATA7) ; port SPI.CLK  [project net SPI.CLK]
USB.D_n: U4.4(USBDM) ; port USB.D_n
USB.D_p: U4.3(USBDP) ; port USB.D_p
Vpp: C15.2 U4.16(N.C.)
NetD7_2: D7.2(K) R13.1
NetD8_2: D8.2(K) R14.1
NetD9_2: D9.2(K) R15.1
NetD10_2: D10.2(K) R16.1
NetR11_2: R11.2 U4.9(~{RST})

Not connected (* = marked no-connect by the designer): MOD1 32(NC)*; U4 1(RI/CLK)* 10(N.C.)* 11(GPIO0.3/WAKEUP)* 12(GPIO0.2/RS485)* 13(GPIO0.1/RXT)* 14(GPIO0.0/TXT)* 15(~{SUSPEND})* 17(SUSPEND)* 18(~{CTS})* 22(~{DSR})* 24(~{DCD})*

### Buses and harness runs
bus ESP.IO[0..39] = port ESP.IO[0..39]
harness I2C = port I2C
harness SPI = port SPI
harness USB = port USB

### Layout directives
net class POWER: 3V3_USB

### Notes on the sheet
- BOOT
- U0TXD
- DL
- Tx
- ESP.DOWNLOAD
- (near MOD1) SPICLK
- U0RXD
- GPIO2
- (near MOD1) GPIO4
- (near MOD1) GPIO5
- LCD CS
- Badge Link
- WS2812
- Rx
- DNU
- (near MOD1) SPIQ
- (near MOD1) SPID
- (near MOD1) SPIHD
- (near MOD1) SPIWP
- (near MOD1) SPICS0
- Combined with internal flash
- IO0	= Download
  IO6-11 	= Shared with Flash
  IO12 	= MTDI , internal PD
  IO15 	= MTDO , internal PU
  IO16-17 	= Shared with PSRAM
  IO34-39 	= Input only
- (near MOD1) U2RXD
- (near MOD1) GPIO12
- (near MOD1) GPIO13
- (near MOD1) GPIO14
- (near MOD1) GPIO15
- SaO IO
- Charge.EN
- LCD BL
- MTDI do not pull high, internal pull-down
- MTDO, internal pull-up
- Combined with internal PSRAM
- (near MOD1) SDA
- (near MOD1) SCL
- (near MOD1) VSPICLK
- (near MOD1) VSPIQ
- (near MOD1) U2TXD
- SPI SCLK
- SPI MISO
- I²C SDA
- I²C SCL
- (near MOD1) VSPID
- (near MOD1) GPIO25
- (near MOD1) GPIO26
- (near MOD1) GPIO27
- (near MOD1) GPIO32
- Buzzer
- IR In + LED
- SPI MOSI
- (near MOD1) GPIO34
- (near MOD1) GPIO35
- (near MOD1) GPIO36
- (near MOD1) GPIO39
- (near MOD1) GPIO33
- Privacy
- Acc Int
- LCD DC
- Battery
- Charge.Status
- Input only
- USB Interface
- USB UART
- (near U4) CP2102N or CP2104
- (near P3) Quick Debug
- (near SW3) Boot
- Title
- Revision
- Date
- Dranw By
- Size
- A3
- Sheet
- of
- (in symbol CP2102N # QFN24 USB UART) CP2102N

### Library data of the parts
C8 C9 C11 C13 = CAP # 100nF 16V 0603: Capacitor Ceramic
C10 C12 C14 C15 = CAP # 10uF 10V 0805: Capacitor Ceramic; Supplier 1: Farnell; Supplier Part Number 1: 2320859
D7 D8 = LED # Red 0805: =Description; Supplier 1: Farnell; Supplier Part Number 1: 2099236
D9 D10 = LED # Green 0805: =Description; Supplier 1: Farnell; Supplier Part Number 1: 2099239
MOD1 = WiFi # MOD ESP-WROVER-32: Value: ESP-WROVER-32; Supplier 1: Espressif; Supplier Part Number 1: ESP-WROVER-32
P3 = HDR # RA SHR 1.0mm 5way - 665105131822: Value: 665105131822; Supplier 1: Wurth; Supplier Part Number 1: 665105131822; Supplier 2: Mouser; Supplier Part Number 2: 710-665105131822
R7-R10 = RES # 5K1 0603: Supplier 1: Farnell; Supplier Part Number 1: 2845922
R11 R13-R16 = RES # 1K2 0603
R12 R17 = RES # 100K 0603
R40 R41 = RES # 100R 0603
SW2 SW3 = SW # TACT small 4.5x4.5mm SMD WS-TASV
T2 T3 = BSS138 N-Ch MOSFET 0.2A 3.2Vgs 60Vds: Supplier 1: Farnell; Supplier Part Number 1: 2432717
U4 = CP2102N # QFN24 USB UART: =Description; Value: CP2102N-A01-GQFN24; Supplier 1: Farnell; Supplier Part Number 1: 2577278; Supplier 2: Digikey; Supplier Part Number 2: 336-3693-ND

## Nets that join several sheets
3V3_AUX: Fri3D_2020_02 (R33.1 R45.1), Fri3D_2020_Peripherals (23 pins), Fri3D_2020_Power (C21.1 U7.5), Fri3D_2020_ESP32 (D7.1 R9.1 R10.1)
3V3_ESP: Fri3D_2020_Power (C19.1 U6.5), Fri3D_2020_ESP32 (7 pins)
GND: Fri3D_2020_02 (19 pins), Fri3D_2020_Peripherals (31 pins), Fri3D_2020_Power (22 pins), Fri3D_2020_ESP32 (19 pins)
VBAT: Fri3D_2020_Power (6 pins), Fri3D_2020_ESP32 (R12.1)
VSYS: Fri3D_2020_02 (J1.1 R34.2 R44.2), Fri3D_2020_Peripherals (6 pins), Fri3D_2020_Power (7 pins)
VUSB: Fri3D_2020_02 (5 pins), Fri3D_2020_Peripherals (C1.1 P5.1 P9.4), Fri3D_2020_Power (8 pins), Fri3D_2020_ESP32 (5 pins)
ACC.INT2: Fri3D_2020_02 (P7.10), Fri3D_2020_Peripherals (R39.2), Fri3D_2020_ESP32 (MOD1.4)
BUZZER: Fri3D_2020_02 (P7.11), Fri3D_2020_Peripherals (R5.1 T1.1), Fri3D_2020_ESP32 (MOD1.8)
CO2.RXD: Fri3D_2020_02 (P7.3), Fri3D_2020_Peripherals (P8.2 P9.3), Fri3D_2020_ESP32 (MOD1.11)
CO2.TXD: Fri3D_2020_02 (P7.6), Fri3D_2020_Peripherals (P8.3 P9.2), Fri3D_2020_Power (R18.1), Fri3D_2020_ESP32 (MOD1.23)
ESP.IO0: Fri3D_2020_02 (P7.9), Fri3D_2020_ESP32 (5 pins)
ESP.IO2: Fri3D_2020_02 (P7.5), Fri3D_2020_Peripherals (D1.4), Fri3D_2020_ESP32 (MOD1.24)
ESP.IO4: Fri3D_2020_02 (P7.17 R35.2 R36.1), Fri3D_2020_ESP32 (MOD1.26)
ESP.IO5: Fri3D_2020_Peripherals (P1.9), Fri3D_2020_ESP32 (MOD1.29)
ESP.IO12: Fri3D_2020_02 (P7.12), Fri3D_2020_Peripherals (R4.2), Fri3D_2020_ESP32 (MOD1.14)
ESP.IO13: Fri3D_2020_02 (P6.6 P7.13), Fri3D_2020_ESP32 (MOD1.16)
ESP.IO14: Fri3D_2020_02 (P7.7), Fri3D_2020_ESP32 (MOD1.13)
ESP.IO25: Fri3D_2020_02 (P7.8), Fri3D_2020_Peripherals (D6.1 D15.1), Fri3D_2020_ESP32 (MOD1.10 R13.2)
ESP.IO27: Fri3D_2020_02 (P7.2), Fri3D_2020_ESP32 (MOD1.12)
ESP.IO33: Fri3D_2020_Peripherals (P1.11), Fri3D_2020_ESP32 (MOD1.9)
ESP.IO34: Fri3D_2020_02 (P7.1), Fri3D_2020_Power (R19.1), Fri3D_2020_ESP32 (MOD1.6)
ESP.IO39: Fri3D_2020_02 (P7.4), Fri3D_2020_ESP32 (MOD1.5)
ESP.RESET: Fri3D_2020_Peripherals (P1.8), Fri3D_2020_ESP32 (6 pins)
I2C.SCL: Fri3D_2020_02 (P6.4 P7.21), Fri3D_2020_Peripherals (P2.4 U1.1 U2.6 U3.2), Fri3D_2020_ESP32 (MOD1.36 R10.2)
I2C.SDA: Fri3D_2020_02 (P6.3 P7.22), Fri3D_2020_Peripherals (P2.3 U1.4 U2.5 U3.4), Fri3D_2020_ESP32 (MOD1.33 R9.2)
LED.DOUT: Fri3D_2020_02 (P6.5), Fri3D_2020_Peripherals (D5.2)
SPI.CLK: Fri3D_2020_02 (P7.14), Fri3D_2020_Peripherals (P1.10), Fri3D_2020_ESP32 (MOD1.30)
SPI.DI: Fri3D_2020_02 (P7.15), Fri3D_2020_ESP32 (MOD1.31)
SPI.DO: Fri3D_2020_02 (P7.16), Fri3D_2020_Peripherals (P1.12), Fri3D_2020_ESP32 (MOD1.37)
USB.D_n: Fri3D_2020_02 (D14.1 J2.A7 J2.B7), Fri3D_2020_ESP32 (U4.4)
USB.D_p: Fri3D_2020_02 (D14.6 J2.A6 J2.B6), Fri3D_2020_ESP32 (U4.3)

## Assembly variants
Default: not fitted C1 C3 C6 D14 D15 J1 MOD2 P2 P3 P4 P5 P5 P5 P6 P8 P8 P9 R3 R4 R18 R19 R28 R31 R34 R44 T4 U2 U3